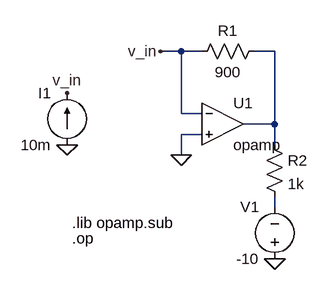
[diagram p0: schematic Draft1.asc]
Draft1.asc, the LTspice schematic file:
Version 4
SHEET 1 880 680
WIRE 160 16 128 16
WIRE 192 16 160 16
WIRE 304 16 272 16
WIRE 160 112 160 16
WIRE 192 112 160 112
WIRE 304 128 304 16
WIRE 304 128 256 128
WIRE 192 144 160 144
WIRE 304 160 304 128
WIRE 160 176 160 144
WIRE 304 256 304 240
FLAG 160 176 0
FLAG 128 16 v_in
FLAG -16 80 v_in
FLAG -16 160 0
FLAG 304 336 0
SYMBOL OpAmps\\opamp 224 64 R0
SYMATTR InstName U1
SYMBOL res 288 0 R90
WINDOW 0 0 56 VBottom 2
WINDOW 3 32 56 VTop 2
SYMATTR InstName R1
SYMATTR Value 900
SYMBOL res 288 144 R0
SYMATTR InstName R2
SYMATTR Value 1k
SYMBOL current -16 160 R180
WINDOW 0 24 80 Left 2
WINDOW 3 24 0 Left 2
WINDOW 123 0 0 Left 0
WINDOW 39 0 0 Left 0
SYMATTR InstName I1
SYMATTR Value 10m
SYMBOL voltage 304 352 R180
WINDOW 0 24 96 Left 2
WINDOW 3 24 16 Left 2
WINDOW 123 0 0 Left 0
WINDOW 39 0 0 Left 0
SYMATTR InstName V1
SYMATTR Value -10
TEXT -8 280 Left 2 !.lib opamp.sub
TEXT -8 304 Left 2 !.op

The netlist it stands for:
* Draft1.asc
XU1 v_in 0 N001 opamp Aol=100K GBW=10Meg  ; pins invin noninvin out
R1 N001 v_in 900
R2 N001 N002 1k
I1 0 v_in 10m
V1 0 N002 -10
.lib opamp.sub
.op
.backanno
.end